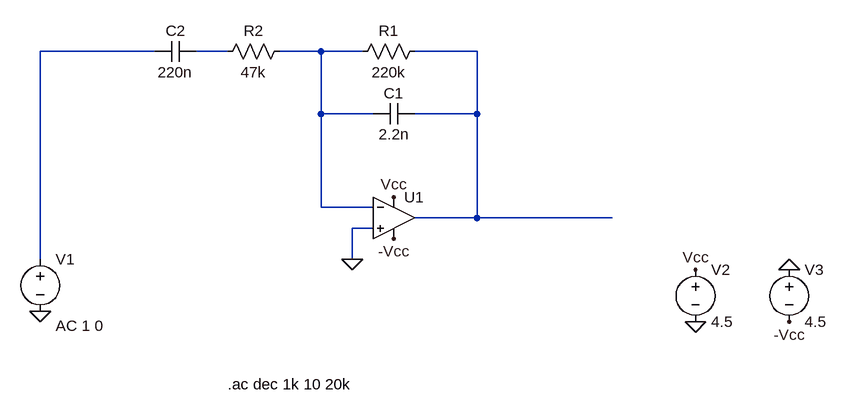
[diagram p0: schematic op-amp3.asc]
op-amp3.asc, the LTspice schematic file:
Version 4
SHEET 1 1200 680
WIRE 160 32 -16 32
WIRE 272 32 224 32
WIRE 416 32 352 32
WIRE 480 32 416 32
WIRE 656 32 560 32
WIRE 416 128 416 32
WIRE 496 128 416 128
WIRE 656 128 656 32
WIRE 656 128 560 128
WIRE 416 272 416 128
WIRE 496 272 416 272
WIRE 656 288 656 128
WIRE 656 288 560 288
WIRE 864 288 656 288
WIRE 496 304 464 304
WIRE -16 352 -16 32
WIRE 464 352 464 304
FLAG 992 448 0
FLAG 1136 368 0
FLAG 992 368 Vcc
FLAG 1136 448 -Vcc
FLAG 528 320 -Vcc
FLAG 528 256 Vcc
FLAG -16 432 0
FLAG 464 352 0
SYMBOL OpAmps/UniversalOpAmp 528 288 R0
SYMATTR InstName U1
SYMBOL voltage -16 336 R0
WINDOW 123 24 118 Left 2
SYMATTR Value2 AC 1 0
SYMATTR InstName V1
SYMATTR Value ""
SYMBOL voltage 992 352 R0
SYMATTR InstName V2
SYMATTR Value 4.5
SYMBOL voltage 1136 352 R0
SYMATTR InstName V3
SYMATTR Value 4.5
SYMBOL cap 560 112 R90
WINDOW 0 0 32 VBottom 2
WINDOW 3 32 32 VTop 2
SYMATTR InstName C1
SYMATTR Value 2.2n
SYMBOL res 576 16 R90
WINDOW 0 0 56 VBottom 2
WINDOW 3 32 56 VTop 2
SYMATTR InstName R1
SYMATTR Value 220k
SYMBOL res 368 16 R90
WINDOW 0 0 56 VBottom 2
WINDOW 3 32 56 VTop 2
SYMATTR InstName R2
SYMATTR Value 47k
SYMBOL cap 224 16 R90
WINDOW 0 0 32 VBottom 2
WINDOW 3 32 32 VTop 2
SYMATTR InstName C2
SYMATTR Value 220n
TEXT 272 544 Left 2 !.ac dec 1k 10 20k

The netlist it stands for:
* op-amp3.asc
XU1 0 N003 Vcc -Vcc N004 level1 Avol=1Meg GBW=10Meg Vos=0 En=0 Enk=0 In=0 Ink=0 Rin=500Meg  ; pins In+ In- V+ V- OUT
V1 N001 0 AC 1 0
V2 Vcc 0 4.5
V3 0 -Vcc 4.5
C1 N004 N003 2.2n
R1 N004 N003 220k
R2 N003 N002 47k
C2 N002 N001 220n
.ac dec 1k 10 20k
.lib UniversalOpAmp1.lib
.backanno
.end